# EAGLE schematic led_matrix (EAGLE 6.5.0)
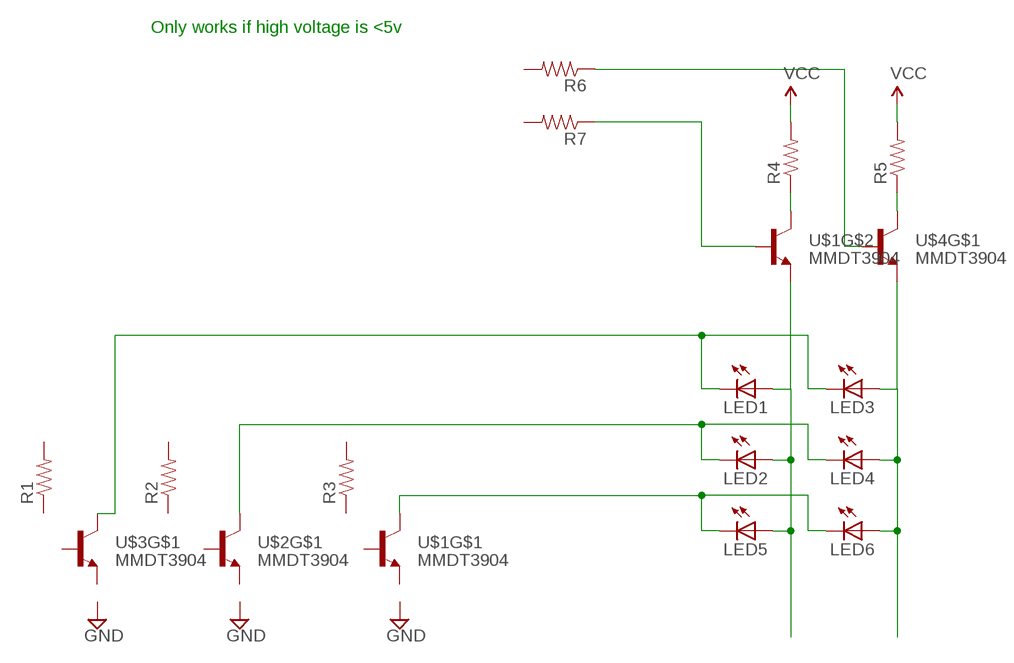
[diagram p0: schematic, sheet 1]

## Parts
LED1  LED0805  [LED_0805]
LED2  LED0805  [LED_0805]
LED3  LED0805  [LED_0805]
LED4  LED0805  [LED_0805]
LED5  LED0805  [LED_0805]
LED6  LED0805  [LED_0805]
R1  RESISTOR0805-RES  [0805]
R2  RESISTOR0805-RES  [0805]
R3  RESISTOR0805-RES  [0805]
R4  RESISTOR0805-RES  [0805]
R5  RESISTOR0805-RES  [0805]
R6  RESISTOR0805-RES  [0805]
R7  RESISTOR0805-RES  [0805]
U$1  MMDT3904  [SOT363]
U$2  MMDT3904  [SOT363]
U$3  MMDT3904  [SOT363]
U$4  MMDT3904  [SOT363]

## Nets
N$1: LED1.C LED3.C U$3.3(C)
N$2: R7.1 U$1.2(B)
N$3: LED1.A LED2.A LED5.A U$1.1(E)
N$4: LED3.A LED4.A LED6.A U$4.4(E)
N$5: LED5.C LED6.C U$1.3(C)
N$6: R6.1 U$4.5(B)
N$7: LED2.C LED4.C U$2.3(C)
N$8: R5.1 U$4.3(C)
N$9: R4.1 U$1.6(C)
VCC: R4.2 R5.2
Unconnected: R1.1 R1.2 R2.1 R2.2 R3.1 R3.2 R6.2 R7.2 U$1.4(E) U$1.5(B) U$2.1(E) U$2.2(B) U$2.4(E) U$2.5(B) U$2.6(C) U$3.1(E) U$3.2(B) U$3.4(E) U$3.5(B) U$3.6(C) U$4.1(E) U$4.2(B) U$4.6(C)

## Notes on the sheet
- Only works if high voltage is <5v

## Library data of the parts
LED1-LED6 = CyberRailGuru:LED: LEDs Standard schematic elements and footprints for 5mm, 3mm, 1206, and 0603 sized LEDs. 5mm - Spark Fun Electronics SKU : COM-00529 (and others)
R1-R7 = SparkFun-Passives:RESISTOR: Resistor Basic schematic elements and footprints for 0603, 1206, and PTH resistors.
U$1-U$4 = SparkFun-DiscreteSemi:MMDT3904: Dual NPN transistor